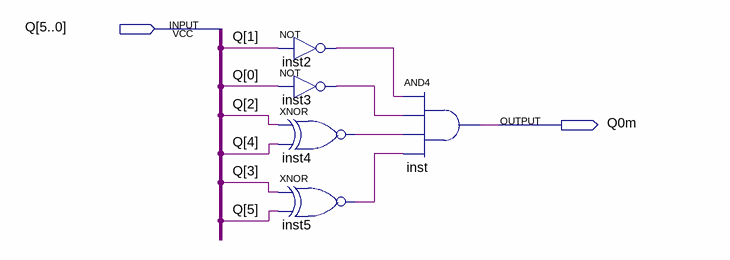
[diagram p0: schematic sheet]
// Quartus schematic GeneradorQ0.bdf as structural Verilog: 5 symbols, 2 pins
module GeneradorQ0 (
  input  [5:0] Q,
  output Q0m
);

  wire inst2_out, inst3_out, inst4_out, inst5_out;

  not inst2 (inst2_out, Q[1]);
  not inst3 (inst3_out, Q[0]);
  xnor inst4 (inst4_out, Q[2], Q[4]);
  xnor inst5 (inst5_out, Q[3], Q[5]);
  and inst (Q0m, inst2_out, inst3_out, inst4_out, inst5_out);
endmodule
